# Altium schematic sheet RTU_LMG_LM2596.SchDoc
size A4; SheetNumber: 13; SheetTotal: 17
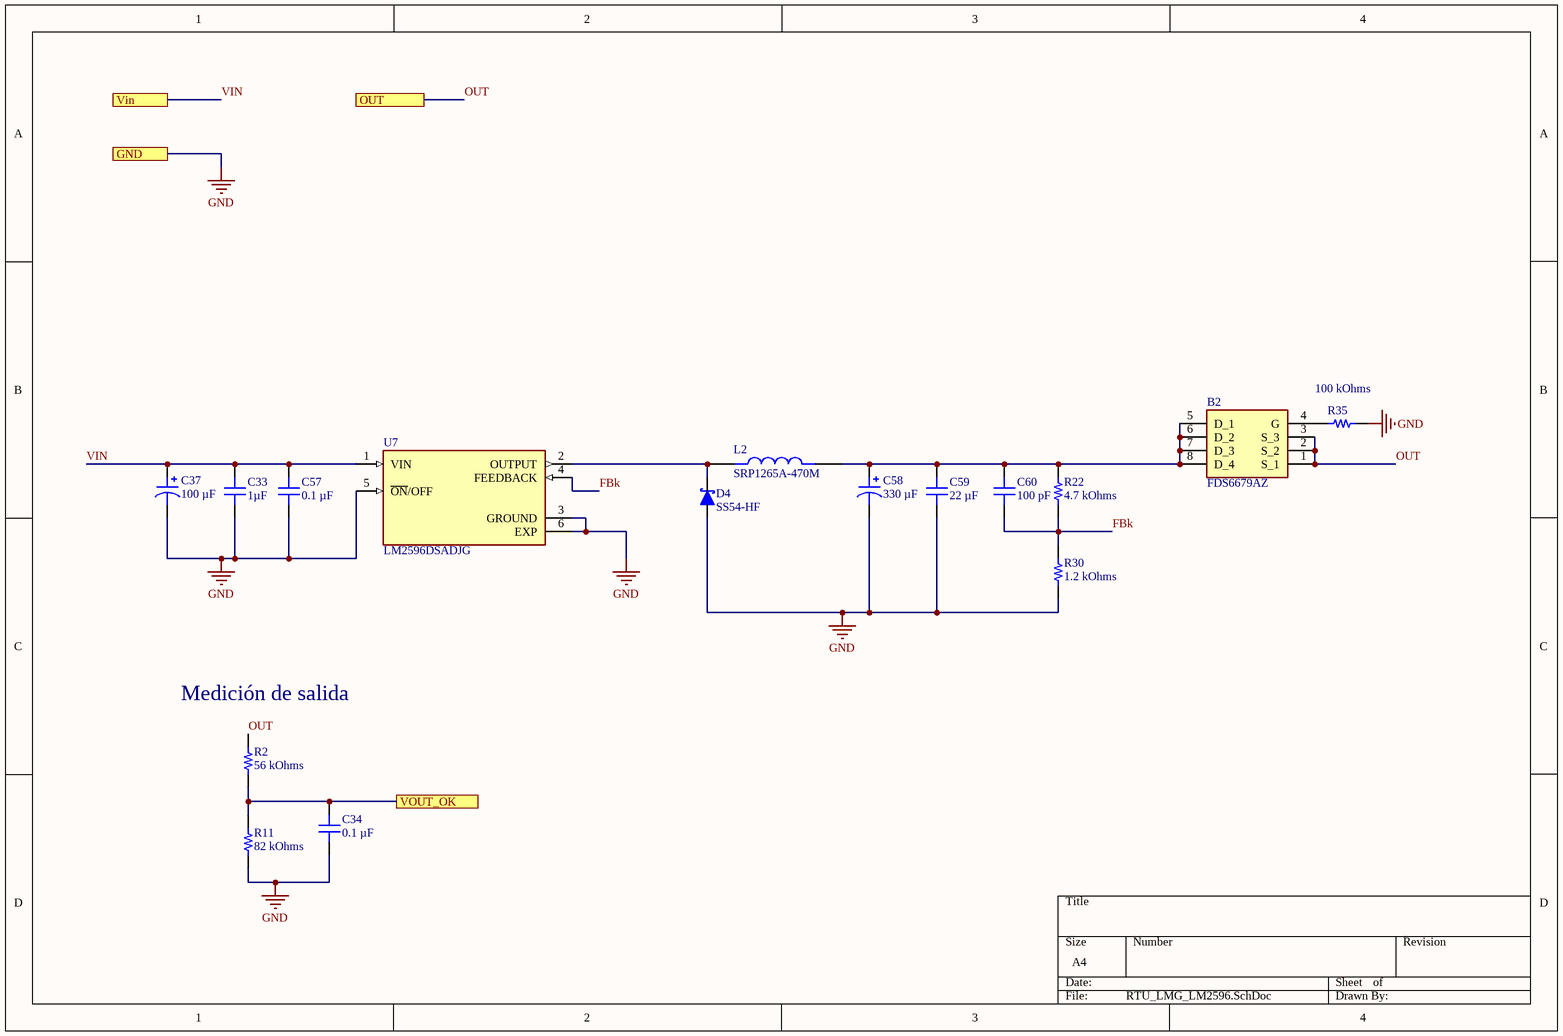
[diagram p0: RTU_LMG_LM2596.SchDoc]

## Parts
B2  FDS6679AZ  [SOIC127P600X175-8N]
C33  1µF  [CAP 0603_1608]
C34  0.1 µF  [CAP 0402_1005]
C37  100 µF  [CAP ALSMD POLY 8.3MM H10.5MM]
C57  0.1 µF  [CAP 0402_1005]
C58  330 µF  [CAP ALSMD 8.3MM H10.5MM]
C59  22 µF  [CAP 0603_1608]
C60  100 pF  [CAP 0603_1608]
D4  SS54-HF  [DIOM5025X220N]
L2  SRP1265A-470M  [IND_SRP1265A-470M]
R2  56 kOhms  [YAGEO RES 0402_1005]
R11  82 kOhms  [YAGEO RES 0402_1005]
R22  4.7 kOhms  [YAGEO RES 0603_1608]
R30  1.2 kOhms  [YAGEO RES 0603_1608]
R35  100 kOhms  [RES 0603_1608]
U7  LM2596DSADJG  [CONV_LM2596DSADJG]

## Ports
GND, OUT, Vin, VOUT_OK

## Nets
GND: C33.1 C34.1 C37.2 C57.1 C58.2 C59.1 D4.2(A) R11.1 R30.1 R35.2 U7.3(GROUND) U7.5(~{ON}/OFF) U7.6(EXP) ; port GND
FBk: C60.1 R22.1 R30.2 U7.4(FEEDBACK)
OUT: B2.1(S_1) B2.2(S_2) B2.3(S_3) R2.2 ; port OUT
VIN: C33.2 C37.1 C57.2 U7.1(VIN) ; port Vin
VOUT_OK: C34.2 R2.1 R11.2 ; port VOUT_OK
NetB2_4: B2.4(G) R35.1
NetB2_5: B2.5(D_1) B2.6(D_2) B2.7(D_3) B2.8(D_4) C58.1 C59.2 C60.2 L2.2 R22.2
NetD4_1: D4.1(K) L2.1 U7.2(OUTPUT)

## Notes on the sheet
- (near R2) Medición de salida

## Library data of the parts
B2 = FDS6679AZ: Max rDS(on) = 14.8m at VGS = -4.5V, ID = -11A; HBM ESD protection level of 6kV typical (note 3); High power and current handing capability; Extended VGS range (-25V) for battery applications; High performance trench technology for extremely lowrDS(on); High power and current handing capability; Max rDS(on) = 9.3mat VGS = -10V, ID = -13A; Manufacturer_Name: onsemi; Geometry.Height: 1.75mm; Mouser Part Number: 512-FDS6679AZ; Mouser Price/Stock: https://www.mouser.co.uk/ProductDetail/onsemi-Fairchild/FDS6679AZ?qs=vnwGVgFuQiZlXnM8io%2FtYg%3D%3D; Manufacturer_Part_Number: FDS6679AZ; Datasheet Link: https://www.onsemi.com/pub/Collateral/FDS6679AZ-D.PDF; ComponentLink1Description: New link; ComponentLink1URL: https://ar.mouser.com/ProductDetail/onsemi-Fairchild/FDS6679AZ?qs=vnwGVgFuQiZlXnM8io%2FtYg%3D%3D; ComponentLink2Description: New link; ComponentLink2URL: https://www.digikey.com/en/products/detail/umw/FDS6679AZ/24889652
C33 = 06035D105MAT2A: CAP CER 1UF 50V X5R 0603; manufacturer: AVX Corporation; Tolerance: ±20%; Part Number: 06035D105MAT2A; Capacitance: 1µF; Applications: General Purpose; componentlink1description: Datasheet; componentlink1url: http://datasheets.avx.com/cx5r.pdf; componentlink2description: DigiKey Link; componentlink2url: http://digikey.com/product-detail/en/avx-corporation/06035D105MAT2A/478-11443-1-ND/8019298; Device Package: 0603 (1608 Metric); lastupdated: 2/9/2020 01:03:34; Lifecycle Status: Active; Minimum Order: 1; Mounting Type: Surface Mount, MLCC; Operating Temperature: -55°C ~ 85°C; Package / Case: 0603 (1608 Metric); packaging: TapeAndReel; partid: 3200; Part Status: Active; price: 0.05; series: -; Size / Dimension: 0.063" L x 0.032" W (1.60mm x 0.81mm); Supplier 1: DigiKey; Supplier Part Number 1: 478-11443-1-ND; Temperature Coefficient: X5R; Thickness (Max): 0.035" (0.90mm); value: 1µF; Voltage - Rated: 50V
C34 C57 = CGA2B3X5R1H104M050BB: CAP CER 0.1UF 50V X5R 0402; manufacturer: TDK Corporation; Tolerance: ±20%; Part Number: CGA2B3X5R1H104M050BB; Capacitance: 0.1 µF; Applications: Automotive; componentlink1description: Datasheet; componentlink1url: https://product.tdk.com/info/en/catalog/datasheets/mlcc_automotive_general_en.pdf?ref_disty=digikey; componentlink2description: DigiKey Link; componentlink2url: https://www.digikey.com/en/products/detail/tdk-corporation/CGA2B3X5R1H104M050BB/3949450; Device Package: 0402 (1005 Metric); lastupdated: 9/2/2024 20:04:38; Lifecycle Status: Active; Minimum Order: 1; Mounting Type: Surface Mount, MLCC; Operating Temperature: -55°C ~ 85°C; Package / Case: 0402 (1005 Metric); packaging: TapeAndReel; partid: 1792; Part Status: Active; price: 0.01; Ratings: AEC-Q200; series: CGA; Size / Dimension: 0.039" L x 0.020" W (1.00mm x 0.50mm); Supplier 1: DigiKey; Supplier Part Number 1: 445-12214-1-ND; Temperature Coefficient: X5R; Thickness (Max): 0.022" (0.55mm); value: 0.1 µF; Voltage - Rated: 50V
C37 = HHXD350ARA101MHA0G: CAP ALUM HYBRD 100UF 20% 35V SMD; manufacturer: United Chemi-Con; ESR (Equivalent Series Resistance): 27mOhm; Lifetime @ Temp.: 5000 Hrs @ 105°C; Ripple Current @ High Frequency: 2.3 A @ 100 kHz; Ripple Current @ Low Frequency: 230 mA @ 120 Hz; Surface Mount Land Size: 0.327" L x 0.327" W (8.30mm x 8.30mm); Type: Hybrid; Part Number: HHXD350ARA101MHA0G; Applications: Automotive; Capacitance: 100 µF; componentlink1description: Datasheet; componentlink1url: http://www.chemi-con.co.jp/cgi-bin/CAT_DB/SEARCH/cat_db_al.cgi?e=e&j=p&pdfname=hxd; componentlink2description: DigiKey Link; componentlink2url: https://www.digikey.com/en/products/detail/united-chemi-con/HHXD350ARA101MHA0G/10486549; Device Package: Radial, Can - SMD; Height - Seated (Max): 0.413" (10.50mm); lastupdated: 3/6/2024 20:17:04; Lifecycle Status: Active; Minimum Order: 1; Mounting Type: Surface Mount; Operating Temperature: -55°C ~ 105°C; Package / Case: Radial, Can - SMD; packaging: TapeAndReel; partid: 2061; Part Status: Active; price: 0.51; Ratings: AEC-Q200; series: HXD; Size / Dimension: 0.315" Dia (8.00mm); Supplier 1: DigiKey; Supplier Part Number 1: 565-HHXD350ARA101MHA0GCT-ND; Tolerance: ±20%; value: 100 µF; Voltage - Rated: 35 V
C58 = 865060353008: CAP ALUM 330UF 20% 16V SMD; manufacturer: Würth Elektronik; Impedance: 170 mOhms; Lifetime @ Temp.: 5000 Hrs @ 105°C; Polarization: Polar; Ripple Current @ High Frequency: 550 mA @ 100 kHz; Ripple Current @ Low Frequency: 357.5 mA @ 120 Hz; Surface Mount Land Size: 0.327" L x 0.327" W (8.30mm x 8.30mm); Part Number: 865060353008; Applications: General Purpose; Capacitance: 330 µF; componentlink1description: Datasheet; componentlink1url: https://katalog.we-online.de/pbs/datasheet/865060353008.pdf; componentlink2description: DigiKey Link; componentlink2url: https://www.digikey.com/en/products/detail/würth-elektronik/865060353008/5728120; Device Package: Radial, Can - SMD; Height - Seated (Max): 0.413" (10.50mm); lastupdated: 3/6/2024 20:15:49; Lifecycle Status: Active; Minimum Order: 1; Mounting Type: Surface Mount; Operating Temperature: -55°C ~ 105°C; Package / Case: Radial, Can - SMD; packaging: TapeAndReel; partid: 7463; Part Status: Active; price: 0.39; series: WCAP-ASLL; Size / Dimension: 0.315" Dia (8.00mm); Supplier 1: DigiKey; Supplier Part Number 1: 732-8525-1-ND; Tolerance: ±20%; value: 330 µF; Voltage - Rated: 16 V
C59 = C1608X5R1A226M080AC: CAP CER 22UF 10V X5R 0603; manufacturer: TDK Corporation; Tolerance: ±20%; Part Number: C1608X5R1A226M080AC; Capacitance: 22 µF; Applications: General Purpose; componentlink1description: Datasheet; componentlink1url: https://product.tdk.com/info/en/catalog/datasheets/mlcc_commercial_general_en.pdf?ref_disty=digikey; componentlink2description: DigiKey Link; componentlink2url: https://www.digikey.com/en/products/detail/tdk-corporation/C1608X5R1A226M080AC/3661560; Device Package: 0603 (1608 Metric); Features: Low ESL; lastupdated: 9/2/2024 20:10:30; Lifecycle Status: Active; Minimum Order: 1; Mounting Type: Surface Mount, MLCC; Operating Temperature: -55°C ~ 85°C; Package / Case: 0603 (1608 Metric); packaging: TapeAndReel; partid: 2684; Part Status: Active; price: 0.08; series: C; Size / Dimension: 0.063" L x 0.031" W (1.60mm x 0.80mm); Supplier 1: DigiKey; Supplier Part Number 1: 445-9077-1-ND; Temperature Coefficient: X5R; Thickness (Max): 0.039" (1.00mm); value: 22 µF; Voltage - Rated: 10V
C60 = 885012206028: CAP CER 100PF 16V X7R 0603; manufacturer: Würth Elektronik; Tolerance: ±10%; Part Number: 885012206028; Capacitance: 100 pF; Applications: General Purpose; componentlink1description: Datasheet; componentlink1url: https://katalog.we-online.de/pbs/datasheet/885012206028.pdf; componentlink2description: DigiKey Link; componentlink2url: https://www.digikey.com/en/products/detail/würth-elektronik/885012206028/5453802; Device Package: 0603 (1608 Metric); lastupdated: 9/2/2024 20:10:28; Lifecycle Status: Active; Minimum Order: 1; Mounting Type: Surface Mount, MLCC; Operating Temperature: -55°C ~ 125°C; Package / Case: 0603 (1608 Metric); packaging: TapeAndReel; partid: 3600; Part Status: Active; price: 0.02; series: WCAP-CSGP; Size / Dimension: 0.063" L x 0.031" W (1.60mm x 0.80mm); Supplier 1: DigiKey; Supplier Part Number 1: 732-7947-1-ND; Temperature Coefficient: X7R; Thickness (Max): 0.034" (0.87mm); value: 100 pF; Voltage - Rated: 16V
D4 = SS54-HF: Diode Schottky 40 V 5A Surface Mount DO-214AC (SMA); MF: Comchip Technology; SnapEDA_Link: https://www.snapeda.com/parts/SS54-HF/Comchip/view-part/?ref=snap; Package: DO-214AC-214 Comchip Technology; Value: *; MP: SS54-HF; Check_prices: https://www.snapeda.com/parts/SS54-HF/Comchip/view-part/?ref=eda
L2 = SRP1265A-470M: Inductor,Shielded Power,AEC-Q200,47uH 20% SMT 1265 | Bourns SRP1265A-470M; SnapEDA_Link: https://www.snapeda.com/parts/SRP1265A-470M/Bourns/view-part/?ref=snap; Package: Nonstandard Bourns; Value: *; MF: Bourns; MP: SRP1265A-470M; Check_prices: https://www.snapeda.com/parts/SRP1265A-470M/Bourns/view-part/?ref=eda
R2 = RC0402FR-0756KL: RES 56K OHM 1% 1/16W 0402; Manufacturer: Yageo; Power (Watts): 0.063W, 1/16W; Temperature Coefficient: ±100ppm/°C; Part Number: RC0402FR-0756KL; Value: 56 kOhms; ComponentLink1Description: Datasheet; ComponentLink1URL: https://www.yageo.com/upload/media/product/productsearch/datasheet/rchip/PYu-RC_Group_51_RoHS_L_10.pdf; ComponentLink2Description: DigiKey Link; ComponentLink2URL: https://www.digikey.com/en/products/detail/yageo/RC0402FR-0756KL/726635; Composition: Thick Film; Device Package: 0402 (1005 Metric); Features: Moisture Resistant; Height - Seated (Max): 0.016" (0.40mm); LastUpdated: 31/8/2025 15:04:18; Lifecycle Status: Active; Minimum Order: 1; Number of Terminations: 2; Operating Temperature: -55°C ~ 155°C; Package / Case: 0402 (1005 Metric); Packaging: CutTape; PartId: 2502; Part Status: Active; Price: 0.01; Resistance: 56 kOhms; Series: RC_L; Size / Dimension: 0.039" L x 0.020" W (1.00mm x 0.50mm); Supplier 1: DigiKey; Supplier Part Number 1: 311-56.0KLRCT-ND; Supplier Device Package: 0402; Tolerance: ±1%
R11 = RC0402FR-0782KL: RES 82K OHM 1% 1/16W 0402; Manufacturer: Yageo; Power (Watts): 0.063W, 1/16W; Temperature Coefficient: ±100ppm/°C; Part Number: RC0402FR-0782KL; Value: 82 kOhms; ComponentLink1Description: Datasheet; ComponentLink1URL: https://www.yageo.com/upload/media/product/productsearch/datasheet/rchip/PYu-RC_Group_51_RoHS_L_10.pdf; ComponentLink2Description: DigiKey Link; ComponentLink2URL: https://www.digikey.com/en/products/detail/yageo/RC0402FR-0782KL/726665; Composition: Thick Film; Device Package: 0402 (1005 Metric); Features: Moisture Resistant; Height - Seated (Max): 0.016" (0.40mm); LastUpdated: 31/8/2025 15:04:18; Lifecycle Status: Active; Minimum Order: 1; Number of Terminations: 2; Operating Temperature: -55°C ~ 155°C; Package / Case: 0402 (1005 Metric); Packaging: CutTape; PartId: 2509; Part Status: Active; Price: 0.01; Resistance: 82 kOhms; Series: RC_L; Size / Dimension: 0.039" L x 0.020" W (1.00mm x 0.50mm); Supplier 1: DigiKey; Supplier Part Number 1: 311-82.0KLRCT-ND; Supplier Device Package: 0402; Tolerance: ±1%
R22 = RT0603FRE074K7L: RES SMD 4.7K OHM 1% 1/10W 0603; Manufacturer: Yageo; Power (Watts): 0.1W, 1/10W; Temperature Coefficient: ±50ppm/°C; Part Number: RT0603FRE074K7L; Value: 4.7 kOhms; ComponentLink1Description: Datasheet; ComponentLink1URL: https://www.yageo.com/upload/media/product/productsearch/datasheet/rchip/PYu-RT_1-to-0.01_RoHS_L_11.pdf; ComponentLink2Description: DigiKey Link; ComponentLink2URL: https://www.digikey.com/en/products/detail/yageo/RT0603FRE074K7L/1075404; Composition: Thin Film; Device Package: 0603 (1608 Metric); Height - Seated (Max): 0.022" (0.55mm); LastUpdated: 25/7/2024 09:19:32; Lifecycle Status: Active; Minimum Order: 1; Number of Terminations: 2; Operating Temperature: -55°C ~ 155°C; Package / Case: 0603 (1608 Metric); Packaging: TapeAndReel; PartId: 5678; Part Status: Active; Price: 0.01; Resistance: 4.7 kOhms; Series: RT; Size / Dimension: 0.063" L x 0.031" W (1.60mm x 0.80mm); Supplier 1: DigiKey; Supplier Part Number 1: YAG1238CT-ND; Supplier Device Package: 0603; Tolerance: ±1%
R30 = RT0603FRE071K2L: RES SMD 1.2K OHM 1% 1/10W 0603; Manufacturer: Yageo; Power (Watts): 0.1W, 1/10W; Temperature Coefficient: ±50ppm/°C; Part Number: RT0603FRE071K2L; Value: 1.2 kOhms; ComponentLink1Description: Datasheet; ComponentLink1URL: https://www.yageo.com/upload/media/product/productsearch/datasheet/rchip/PYu-RT_1-to-0.01_RoHS_L_11.pdf; ComponentLink2Description: DigiKey Link; ComponentLink2URL: https://www.digikey.com/en/products/detail/yageo/RT0603FRE071K2L/1075167; Composition: Thin Film; Device Package: 0603 (1608 Metric); Height - Seated (Max): 0.022" (0.55mm); LastUpdated: 25/7/2024 09:19:32; Lifecycle Status: Active; Minimum Order: 1; Number of Terminations: 2; Operating Temperature: -55°C ~ 155°C; Package / Case: 0603 (1608 Metric); Packaging: TapeAndReel; PartId: 5172; Part Status: Active; Price: 0.01; Resistance: 1.2 kOhms; Series: RT; Size / Dimension: 0.063" L x 0.031" W (1.60mm x 0.80mm); Supplier 1: DigiKey; Supplier Part Number 1: YAG5943CT-ND; Supplier Device Package: 0603; Tolerance: ±1%
R35 = RNCS0603BKE100K: RES 100K OHM 0.1% 1/16W 0603; Manufacturer: Stackpole Electronics Inc; Power (Watts): 0.063W, 1/16W; Temperature Coefficient: ±25ppm/°C; Part Number: RNCS0603BKE100K; Value: 100 kOhms; ComponentLink1Description: Datasheet; ComponentLink1URL: https://www.seielect.com/catalog/sei-rncs_rnch.pdf; ComponentLink2Description: DigiKey Link; ComponentLink2URL: https://www.digikey.com/en/products/detail/stackpole-electronics-inc/RNCS0603BKE100K/1708835; Composition: Thin Film; Device Package: 0603 (1608 Metric); Features: Anti-Corrosive, Automotive AEC-Q200, Moisture Resistant; Height - Seated (Max): 0.022" (0.55mm); LastUpdated: 9/2/2024 20:43:37; Lifecycle Status: Active; Minimum Order: 1; Number of Terminations: 2; Operating Temperature: -55°C ~ 155°C; Package / Case: 0603 (1608 Metric); Packaging: TapeAndReel; PartId: 4849; Part Status: Active; Price: 0.06; Ratings: AEC-Q200; Resistance: 100 kOhms; Series: RNCS; Size / Dimension: 0.061" L x 0.031" W (1.55mm x 0.80mm); Supplier 1: DigiKey; Supplier Part Number 1: RNCS0603BKE100KCT-ND; Supplier Device Package: 0603; Tolerance: ±0.1%
U7 = LM2596DSADJG: LM2596DSADJG Switching Regulator 3A Adjustable, 1.23 to 37 V, 5-Pin D2PAK | ON Semiconductor LM2596DSADJG; SnapEDA_Link: https://www.snapeda.com/parts/LM2596DSADJG/Onsemi/view-part/?ref=snap; Package: D2PAK-5 ON Semiconductor; Value: *; MF: ON Semiconductor; MP: LM2596DSADJG; Check_prices: https://www.snapeda.com/parts/LM2596DSADJG/Onsemi/view-part/?ref=eda; ComponentLink1Description: https://www.digikey.com/en/products/detail/taejin/LM2596R-5-0/22237253; ComponentLink1URL: *